# EAGLE board BlackIce (EAGLE 6.6.0), part 1 of 2
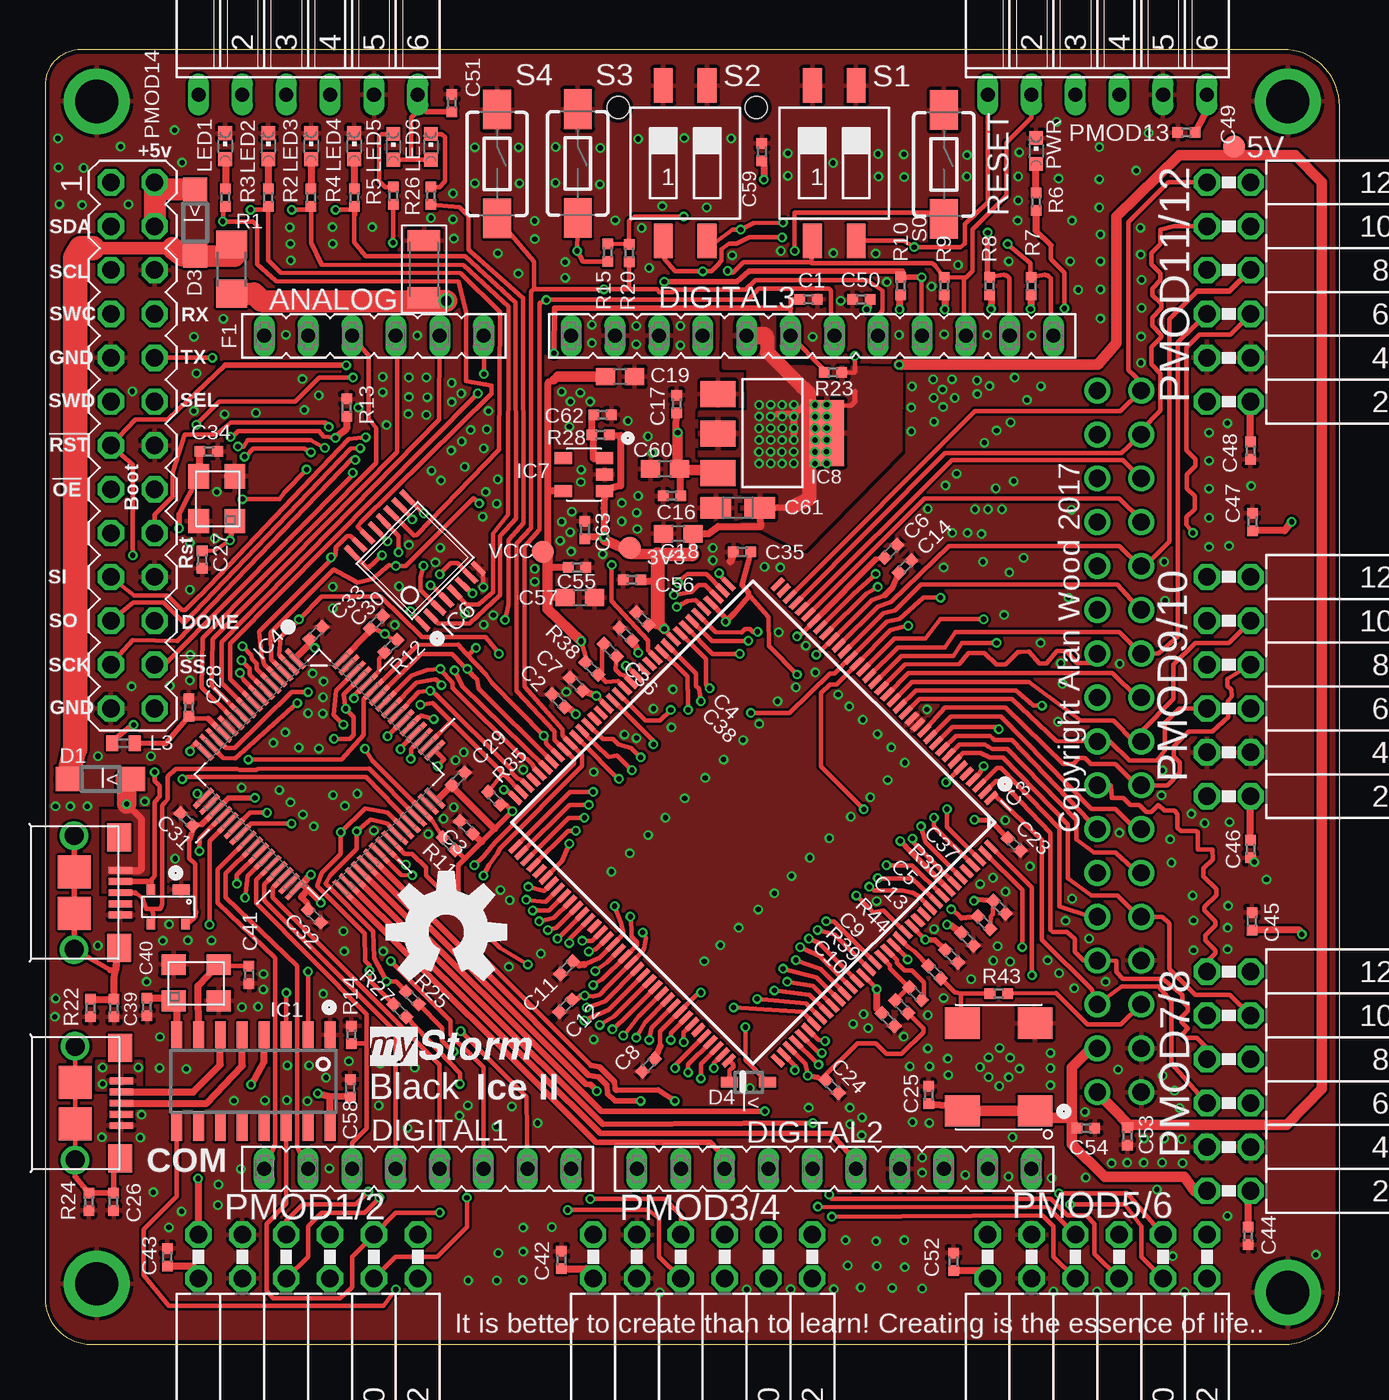
[diagram p2: board, top side]
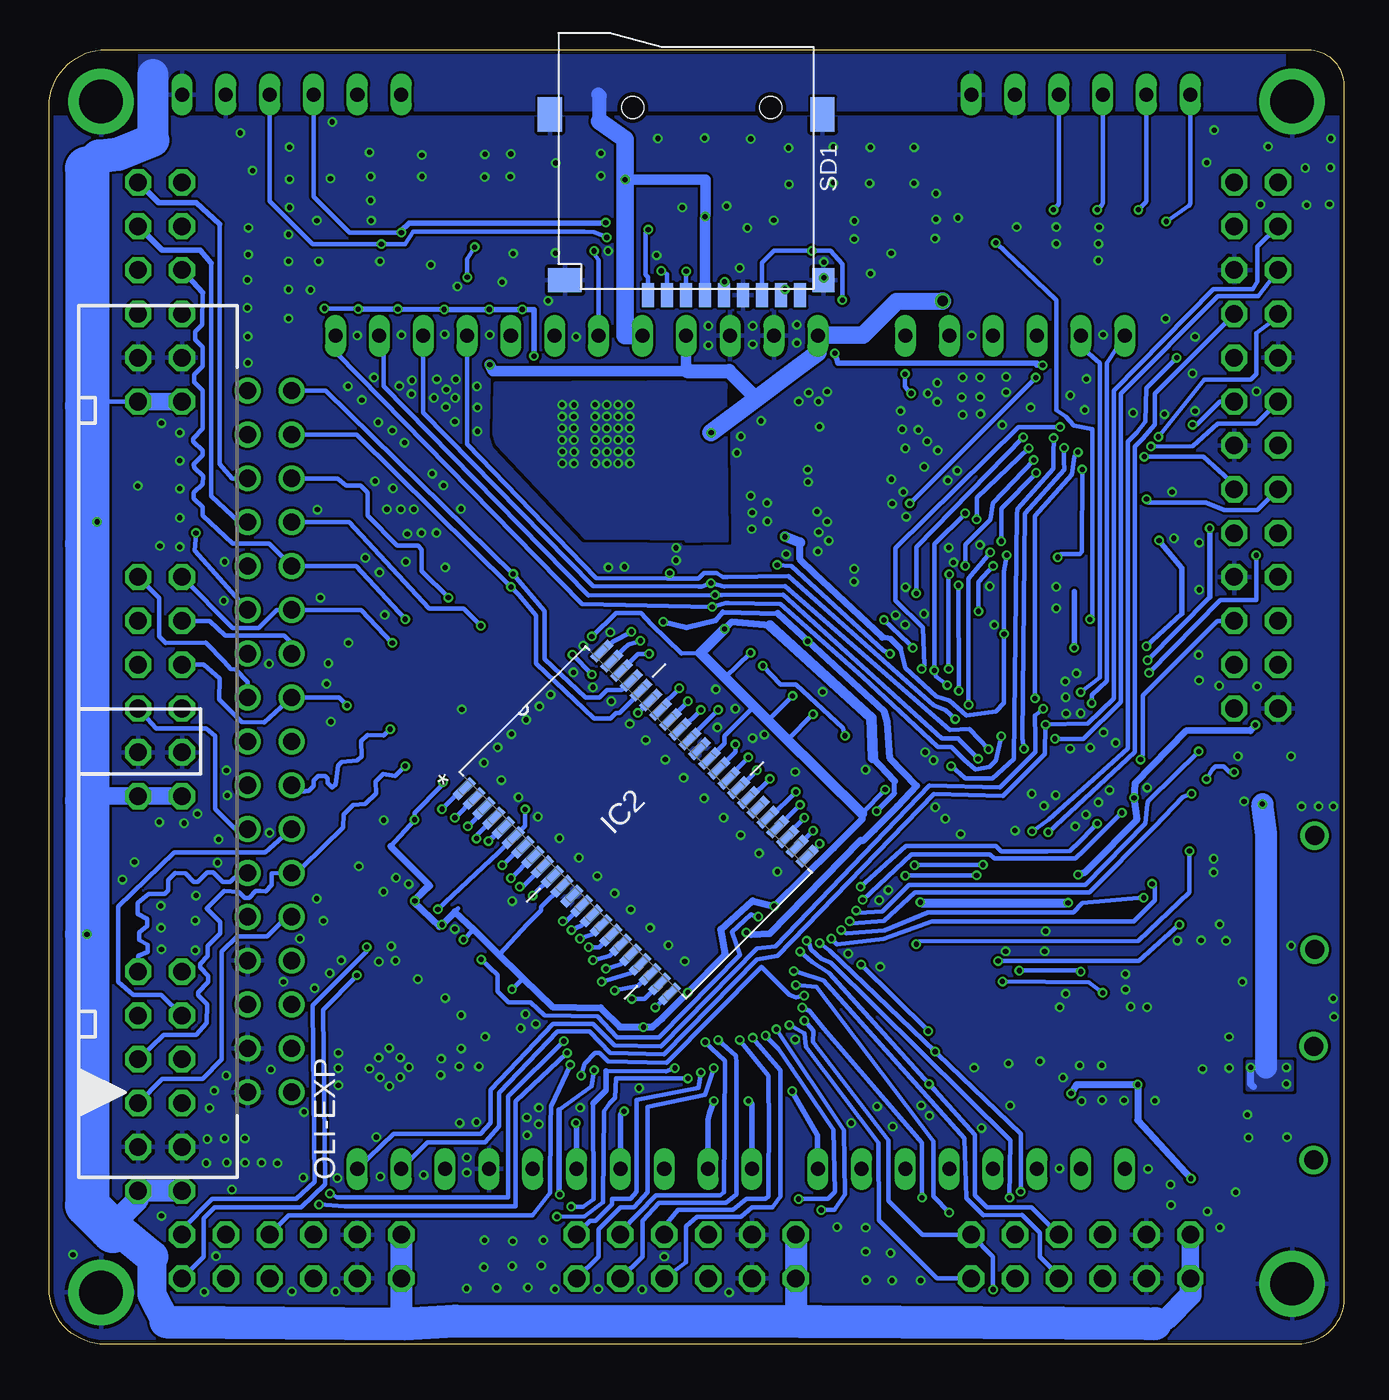
[diagram p3: board, bottom side, seen from below]

Size 75 x 75 mm. Coordinates in mm from the lower left corner, seen from the top.
Outline: 71.73,75 2.09,75 arc90 0,72.91 0,2.67 arc90 2.67,0 71.78,0 arc90 75,3.22 75,71.73 arc90 71.73,75
Copper layers (1*16): Top 0.018mm / dielectric 1.55mm / Bottom 0.018mm
Design rules "eC_2Layer_PClass6_BaseCopperO18_eCDefault *": minimum track width 0.15mm, minimum drill 0.3mm, track to track 0.15mm, track to pad 0.15mm, pad to pad 0.15mm, via to via 0.15mm, smd to smd 0mil, copper to edge 0.25mm, drill to drill 0.35mm, minimum pad ring 0.175mm, minimum via ring 0.125mm, stop-mask expansion 0mil, vias tented up to drill 0.45mm, thermal gap 0.2mm
Net classes: 2 thin_power: width 0.254 mm

## Footprints (pad centres in the part's own frame; a part is rotated, then mirrored left to right if it is on the bottom)
B1,27 = smd 1.27 x 1.27: TP 0,0
FE06 = drill 0.813 long: 1 -6.35,0; 2 -3.81,0; 3 -1.27,0; 4 1.27,0; 5 3.81,0; 6 6.35,0
C0402 = smd 0.61 x 0.61: 1 -0.508,0; 2 0.508,0
C0603 = smd 1.1 x 1: 1 -0.85,0; 2 0.85,0
1206 = smd 1.219 x 1.88: 1 -1.651,0; 2 1.651,0
R/2012-12W = smd 1.75 x 1.26: + 1.275,0; - -1.275,0
MICROUSB-B-PEG = smd 0.4 x 1.35: P$1 -1.3,2.675; P$2 -0.65,2.675; P$3 0,2.675; P$4 0.65,2.675; P$5 1.3,2.675 | drill 1.1: SH5 -3.3,0; SH6 3.3,0 | smd 1.6 x 1.4: SH@1 -3.2,2.6; SH@4 3.2,2.6 | smd 1.9 x 1.9: SH@2 -1.2,0; SH@3 1.2,0
MA13-2 = drill 1.016 octagon: 1 -15.24,-1.27; 2 -15.24,1.27; 3 -12.7,-1.27; 4 -12.7,1.27; 5 -10.16,-1.27; 6 -10.16,1.27; 7 -7.62,-1.27; 8 -7.62,1.27; 9 -5.08,-1.27; 10 -5.08,1.27; 11 -2.54,-1.27; 12 -2.54,1.27; 13 0,-1.27; 14 0,1.27; 15 2.54,-1.27; 16 2.54,1.27; 17 5.08,-1.27; 18 5.08,1.27; 19 7.62,-1.27; 20 7.62,1.27; 21 10.16,-1.27; 22 10.16,1.27; 23 12.7,-1.27; 24 12.7,1.27; 25 15.24,-1.27; 26 15.24,1.27
SOD123 = smd 1.4 x 1.4: A 1.9,0; C -1.9,0
SOD-323 = smd 1 x 0.6: A 1.1,0; C -1.1,0
FE08 = drill 0.813 long: 1 -8.89,0; 2 -6.35,0; 3 -3.81,0; 4 -1.27,0; 5 1.27,0; 6 3.81,0; 7 6.35,0; 8 8.89,0
FE10 = drill 0.813 long: 1 -11.43,0; 2 -8.89,0; 3 -6.35,0; 4 -3.81,0; 5 -1.27,0; 6 1.27,0; 7 3.81,0; 8 6.35,0; 9 8.89,0; 10 11.43,0
FE12 = drill 0.813 long: 1 -13.97,0; 2 -11.43,0; 3 -8.89,0; 4 -6.35,0; 5 -3.81,0; 6 -1.27,0; 7 1.27,0; 8 3.81,0; 9 6.35,0; 10 8.89,0; 11 11.43,0; 12 13.97,0
SOT143B = smd 1 x 0.6: 1 -0.75,-1 | smd 0.5 x 0.6: 2 1,-1; 3 1,1; 4 -1,1
R1206 = smd 1.6 x 1.803: 1 -1.422,0; 2 1.422,0
SOIC16 = smd 0.635 x 1.524: 1 -4.445,-2.695; 2 -3.175,-2.695; 3 -1.905,-2.695; 4 -0.635,-2.695; 5 0.635,-2.695; 6 1.905,-2.695; 7 3.175,-2.695; 8 4.445,-2.695; 9 4.445,2.695; 10 3.175,2.695; 11 1.905,2.695; 12 0.635,2.695; 13 -0.635,2.695; 14 -1.905,2.695; 15 -3.175,2.695; 16 -4.445,2.695
SOP80P1176X120-44N = smd 1.397 x 0.508: 1 -5.639,8.407; 2 -5.639,7.595; 3 -5.639,6.807; 4 -5.639,5.994; 5 -5.639,5.207; 6 -5.639,4.394; 7 -5.639,3.607; 8 -5.639,2.794; 9 -5.639,2.007; 10 -5.639,1.194; 11 -5.639,0.406; 12 -5.639,-0.406; 13 -5.639,-1.194; 14 -5.639,-2.007; 15 -5.639,-2.794; 16 -5.639,-3.607; 17 -5.639,-4.394; 18 -5.639,-5.207; 19 -5.639,-5.994; 20 -5.639,-6.807; 21 -5.639,-7.595; 22 -5.639,-8.407; 23 5.639,-8.407; 24 5.639,-7.595; 25 5.639,-6.807; 26 5.639,-5.994; 27 5.639,-5.207; 28 5.639,-4.394; 29 5.639,-3.607; 30 5.639,-2.794; 31 5.639,-2.007; 32 5.639,-1.194; 33 5.639,-0.406; 34 5.639,0.406; 35 5.639,1.194; 36 5.639,2.007; 37 5.639,2.794; 38 5.639,3.607; 39 5.639,4.394; 40 5.639,5.207; 41 5.639,5.994; 42 5.639,6.807; 43 5.639,7.595; 44 5.639,8.407
TQFP144 = smd 0.9 x 0.3: 1 -10.75,8.75; 2 -10.75,8.25; 3 -10.75,7.75; 4 -10.75,7.25; 5 -10.75,6.75; 6 -10.75,6.25; 7 -10.75,5.75; 8 -10.75,5.25; 9 -10.75,4.75; 10 -10.75,4.25; 11 -10.75,3.75; 12 -10.75,3.25; 13 -10.75,2.75; 14 -10.75,2.25; 15 -10.75,1.75; 16 -10.75,1.25; 17 -10.75,0.75; 18 -10.75,0.25; 19 -10.75,-0.25; 20 -10.75,-0.75; 21 -10.75,-1.25; 22 -10.75,-1.75; 23 -10.75,-2.25; 24 -10.75,-2.75; 25 -10.75,-3.25; 26 -10.75,-3.75; 27 -10.75,-4.25; 28 -10.75,-4.75; 29 -10.75,-5.25; 30 -10.75,-5.75; 31 -10.75,-6.25; 32 -10.75,-6.75; 33 -10.75,-7.25; 34 -10.75,-7.75; 35 -10.75,-8.25; 36 -10.75,-8.75; 73 10.75,-8.75; 74 10.75,-8.25; 75 10.75,-7.75; 76 10.75,-7.25; 77 10.75,-6.75; 78 10.75,-6.25; 79 10.75,-5.75; 80 10.75,-5.25; 81 10.75,-4.75; 82 10.75,-4.25; 83 10.75,-3.75; 84 10.75,-3.25; 85 10.75,-2.75; 86 10.75,-2.25; 87 10.75,-1.75; 88 10.75,-1.25; 89 10.75,-0.75; 90 10.75,-0.25; 91 10.75,0.25; 92 10.75,0.75; 93 10.75,1.25; 94 10.75,1.75; 95 10.75,2.25; 96 10.75,2.75; 97 10.75,3.25; 98 10.75,3.75; 99 10.75,4.25; 100 10.75,4.75; 101 10.75,5.25; 102 10.75,5.75; 103 10.75,6.25; 104 10.75,6.75; 105 10.75,7.25; 106 10.75,7.75; 107 10.75,8.25; 108 10.75,8.75 | smd 0.3 x 0.9: 37 -8.75,-10.75; 38 -8.25,-10.75; 39 -7.75,-10.75; 40 -7.25,-10.75; 41 -6.75,-10.75; 42 -6.25,-10.75; 43 -5.75,-10.75; 44 -5.25,-10.75; 45 -4.75,-10.75; 46 -4.25,-10.75; 47 -3.75,-10.75; 48 -3.25,-10.75; 49 -2.75,-10.75; 50 -2.25,-10.75; 51 -1.75,-10.75; 52 -1.25,-10.75; 53 -0.75,-10.75; 54 -0.25,-10.75; 55 0.25,-10.75; 56 0.75,-10.75; 57 1.25,-10.75; 58 1.75,-10.75; 59 2.25,-10.75; 60 2.75,-10.75; 61 3.25,-10.75; 62 3.75,-10.75; 63 4.25,-10.75; 64 4.75,-10.75; 65 5.25,-10.75; 66 5.75,-10.75; 67 6.25,-10.75; 68 6.75,-10.75; 69 7.25,-10.75; 70 7.75,-10.75; 71 8.25,-10.75; 72 8.75,-10.75; 109 8.75,10.75; 110 8.25,10.75; 111 7.75,10.75; 112 7.25,10.75; 113 6.75,10.75; 114 6.25,10.75; 115 5.75,10.75; 116 5.25,10.75; 117 4.75,10.75; 118 4.25,10.75; 119 3.75,10.75; 120 3.25,10.75; 121 2.75,10.75; 122 2.25,10.75; 123 1.75,10.75; 124 1.25,10.75; 125 0.75,10.75; 126 0.25,10.75; 127 -0.25,10.75; 128 -0.75,10.75; 129 -1.25,10.75; 130 -1.75,10.75; 131 -2.25,10.75; 132 -2.75,10.75; 133 -3.25,10.75; 134 -3.75,10.75; 135 -4.25,10.75; 136 -4.75,10.75; 137 -5.25,10.75; 138 -5.75,10.75; 139 -6.25,10.75; 140 -6.75,10.75; 141 -7.25,10.75; 142 -7.75,10.75; 143 -8.25,10.75; 144 -8.75,10.75
QFP50P1200X1200X160-64N = smd 1.473 x 0.279: 1 -5.715,3.759; 2 -5.715,3.251; 3 -5.715,2.743; 4 -5.715,2.261; 5 -5.715,1.753; 6 -5.715,1.245; 7 -5.715,0.762; 8 -5.715,0.254; 9 -5.715,-0.254; 10 -5.715,-0.762; 11 -5.715,-1.245; 12 -5.715,-1.753; 13 -5.715,-2.261; 14 -5.715,-2.743; 15 -5.715,-3.251; 16 -5.715,-3.759; 33 5.715,-3.759; 34 5.715,-3.251; 35 5.715,-2.743; 36 5.715,-2.261; 37 5.715,-1.753; 38 5.715,-1.245; 39 5.715,-0.762; 40 5.715,-0.254; 41 5.715,0.254; 42 5.715,0.762; 43 5.715,1.245; 44 5.715,1.753; 45 5.715,2.261; 46 5.715,2.743; 47 5.715,3.251; 48 5.715,3.759 | smd 0.279 x 1.473: 17 -3.759,-5.715; 18 -3.251,-5.715; 19 -2.743,-5.715; 20 -2.261,-5.715; 21 -1.753,-5.715; 22 -1.245,-5.715; 23 -0.762,-5.715; 24 -0.254,-5.715; 25 0.254,-5.715; 26 0.762,-5.715; 27 1.245,-5.715; 28 1.753,-5.715; 29 2.261,-5.715; 30 2.743,-5.715; 31 3.251,-5.715; 32 3.759,-5.715; 49 3.759,5.715; 50 3.251,5.715; 51 2.743,5.715; 52 2.261,5.715; 53 1.753,5.715; 54 1.245,5.715; 55 0.762,5.715; 56 0.254,5.715; 57 -0.254,5.715; 58 -0.762,5.715; 59 -1.245,5.715; 60 -1.753,5.715; 61 -2.261,5.715; 62 -2.743,5.715; 63 -3.251,5.715; 64 -3.759,5.715
TSSOP-16 = smd 0.305 x 0.991: 1 -2.275,-2.918; 2 -1.625,-2.918; 3 -0.975,-2.918; 4 -0.325,-2.918; 5 0.325,-2.918; 6 0.975,-2.918; 7 1.625,-2.918; 8 2.275,-2.918; 9 2.275,2.918; 10 1.625,2.918; 11 0.975,2.918; 12 0.325,2.918; 13 -0.325,2.918; 14 -0.975,2.918; 15 -1.625,2.918; 16 -2.275,2.918
TSOP-5/SOT23-5 = smd 0.7 x 1: 1 0.95,1.2; 2 0,1.2; 3 -0.95,1.2; 4 -0.95,-1.2; 5 0.95,-1.2
SOT223 = smd 1.499 x 2.007: 1 -2.261,-3.15; 2 0.025,-3.15; 3 2.311,-3.15 | smd 3.81 x 2.007: 4 0,3.15
C0402' = smd 0.7 x 0.9: 1 -0.65,0; 2 0.65,0
CHIPLED_0603 = smd 0.8 x 0.8: A 0,-0.75; C 0,0.75
PAK100/2500-5-34 = drill 1 pad 1.422: 1 -20.32,-1.27; 2 -20.32,1.27; 3 -17.78,-1.27; 4 -17.78,1.27; 5 -15.24,-1.27; 6 -15.24,1.27; 7 -12.7,-1.27; 8 -12.7,1.27; 9 -10.16,-1.27; 10 -10.16,1.27; 11 -7.62,-1.27; 12 -7.62,1.27; 13 -5.08,-1.27; 14 -5.08,1.27; 15 -2.54,-1.27; 16 -2.54,1.27; 17 0,-1.27; 18 0,1.27; 19 2.54,-1.27; 20 2.54,1.27; 21 5.08,-1.27; 22 5.08,1.27; 23 7.62,-1.27; 24 7.62,1.27; 25 10.16,-1.27; 26 10.16,1.27; 27 12.7,-1.27; 28 12.7,1.27; 29 15.24,-1.27; 30 15.24,1.27; 31 17.78,-1.27; 32 17.78,1.27; 33 20.32,-1.27; 34 20.32,1.27
FE06-2W = drill 1.016 octagon: 1 -6.35,1.27; 2 -6.35,-1.27; 3 -3.81,1.27; 4 -3.81,-1.27; 5 -1.27,1.27; 6 -1.27,-1.27; 7 1.27,1.27; 8 1.27,-1.27; 9 3.81,1.27; 10 3.81,-1.27; 11 6.35,1.27; 12 6.35,-1.27
FE06W = drill 0.813 long: 1 -6.35,0; 2 -3.81,0; 3 -1.27,0; 4 1.27,0; 5 3.81,0; 6 6.35,0
R0402 = smd 0.61 x 0.61: 1 -0.508,0; 2 0.508,0
TACTILE-SWITCH-1101NE = smd 2.3 x 1.6: 1 -3.15,0; 2 3.15,0
SMS-002 = smd 1.092 x 2.007: 1 -1.27,-4.496; 2 1.27,-4.496; 3 1.27,4.496; 4 -1.27,4.496
TF-PULL = smd 0.7 x 1.4: 1 -2.2,-7.62; 2 -1.1,-7.62; 3 0,-7.62; 4 1.1,-7.62; 5 2.2,-7.62; 6 3.3,-7.62; 7 4.4,-7.62; 8 5.5,-7.62; 9 6.6,-7.62 | smd 1.4 x 2: S1 -7.9,2.85; S2 7.9,2.85 | smd 1.28 x 1.4: S3 7.96,-6.75 | smd 1.95 x 1.4: S4 -7.025,-6.75 | hole 1.25: -3.1,3.25; 4.9,3.25
2.5MM-HOLE = drill 2.5 pad 3.81: P$1 0,0
XTAL-7X5 = smd 1.8 x 2: P1 -2.54,-2.1; P2 2.54,-2.1; P3 2.54,2.1; P4 -2.54,2.1
CRYSTAL-3.2X2.5 = smd 1.4 x 1.2: 1 -1.3,-1; 2 1.3,-1; 3 1.3,1.1; 4 -1.3,1.1

## Placement (x,y rotation side)
3V3  TPB1,27  [B1,27]  33.87,46.15 0 top
5V  TPB1,27  [B1,27]  68.88,69.4 0 top
ANALOG  [FE06]  19.05,58.42 180 top
C1  100nf  [C0402]  44.23,60.53 0 top
C2  100nf  [C0402]  29.73,37.28 135 top
C3  100nf  [C0402]  24.41,29.94 135 top
C4  100nf  [C0402]  34.61,42.03 135 top
C5  100nf  [C0402]  53.44,23.47 315 top
C6  100nf  [C0402]  49,45.94 225 top
C7  100nf  [C0402]  30.77,38.23 135 top
C8  100nf  [C0402]  34.96,16.17 225 top
C9  4u7  [C0402]  50.42,20.32 135 top
C10  100nf  [C0402]  48.84,18.8 135 top
C11  100nf  [C0402]  30.21,21.82 225 top
C12  100nf  [C0402]  30.17,19.61 225 top
C13  100nf  [C0402]  52.52,22.48 315 top
C14  100nf  [C0402]  49.82,45.06 45 top
C16  4.7uf  [C0402]  36.31,49.14 180 top
C17  4.7uf  [C0402]  36.59,54.47 90 top
C18  10uF  [C0603]  36.68,46.96 180 top
C19  10uF  [C0603]  33.31,56.06 0 top
C20  47uF  [1206]  21.95,62.28 90 top
C23  100nf  [C0402]  56.14,28.96 315 top
C24  100nf  [C0402]  45.59,14.93 135 top
C25  100nf  [C0402]  51.19,14.44 270 top
C26  4n7  [C0402]  3.97,8.26 90 top
C27  22pf  [C0402]  9.1,45.45 90 top
C28  100nf  [C0402]  8.33,36.89 270 top
C29  100nf  [C0402]  23.95,32.75 225 top
C30  100nf  [C0402]  19.19,41.84 225 top
C31  100nf  [C0402]  8.2,30.4 315 top
C32  4u7  [C0402]  15.61,24.81 135 top
C33  100nf  [C0402]  15.7,41.2 225 top
C34  22pf  [C0402]  9.49,51.72 180 top
C35  100nf  [C0402]  40.38,45.9 180 top
C36  4u7  [C0402]  32.75,40.21 135 top
C37  100nf  [C0402]  55.29,25.33 315 top
C38  100nf  [C0402]  33.65,41.12 135 top
C39  4n7  [C0402]  4,19.48 90 top
C40  22pf  [C0402]  5.91,19.55 90 top
C41  22pf  [C0402]  11.82,21.41 90 top
C42  4u7  [C0402]  29.92,4.89 90 top
C43  4u7  [C0402]  7.08,5.04 90 top
C44  4u7  [C0402]  69.7,6.28 270 top
C45  4u7  [C0402]  69.91,24.51 90 top
C46  100nf  [C0402]  69.83,28.68 270 top
C47  4u7  [C0402]  69.94,47.63 90 top
C48  4u7  [C0402]  69.84,51.76 270 top
C49  4u7  [C0402]  66.12,70.2 180 top
C50  4u7  [C0402]  47.29,60.52 180 top
C51  4u7  [C0402]  23.57,71.91 90 top
C52  4u7  [C0402]  52.63,4.79 90 top
C53  100nf  [C0402]  62.7,12.05 270 top
C54  100nf  [C0402]  60.3,12.53 0 top
C55  4u7  [C0402]  30.83,45 0 top
C56  100nf  [C0402]  34,44.29 180 top
C57  22uf  [C0603]  30.99,43.26 0 top
C58  100nf  [C0402]  17.68,14.83 270 top
C59  100nf  [C0402]  41.53,69.06 90 top
C60  22uf  [C0603]  35.92,50.71 180 top
C61  47uf  [R/2012-12W]  40.13,48.45 0 top
C62  100nf  [C0402]  32.3,53.85 180 top
C63  100nf  [C0402]  31.28,47.18 270 top
COM  FCI-MICROUSB-B-PEG  [MICROUSB-B-PEG]  1.75,13.97 270 top
COMS  [MA13-2]  5.08,52.07 270 top
D1  [SOD123]  3.21,32.75 0 top
D3  [SOD123]  8.69,64.97 90 top
D4  BAS70J  [SOD-323]  40.76,15.18 0 top
DIGITAL1  [FE08]  21.59,10.16 0 top
DIGITAL2  [FE10]  45.72,10.16 0 top
DIGITAL3  [FE12]  44.45,58.42 180 top
ESD1  PRTR5V0U2X  [SOT143B]  7.14,25.34 180 top
F1  [R1206]  10.8,62.29 270 top
IC1  CH340G  [SOIC16]  12.06,15.24 180 top
IC2  IS62WV25616DBLL-10TLI  [SOP80P1176X120-44N]  41.02,30.23 45 bottom
IC3  ICE40HX4K_TQFP144  [TQFP144]  41.02,30.23 225 top
IC4  STM32F103RET6  [QFP50P1200X1200X160-64N]  15.88,33.02 315 top
IC6  74CBTLV3257  [TSSOP-16]  21.43,45.4 45 top
IC7  NCP114  [TSOP-5/SOT23-5]  31.22,50.38 270 top
IC8  REG1117-5  [SOT223]  42.14,52.78 270 top
L3  1000R  [C0402']  4.55,34.82 0 top
LED1  [CHIPLED_0603]  10.44,69.41 0 top
LED2  [CHIPLED_0603]  12.94,69.41 0 top
LED3  [CHIPLED_0603]  15.41,69.41 0 top
LED4  [CHIPLED_0603]  17.91,69.41 0 top
LED5  [CHIPLED_0603]  20.18,69.37 0 top
LED6  [CHIPLED_0603]  22.35,69.37 0 top
OLI-EXP  2534-5  [PAK100/2500-5-34]  62.23,34.92 90 bottom
OSHW  OSHW-LOGOL  [OSHW-LOGO-L]  23.25,23.88 0 top
PMOD1/2  [FE06-2W]  15.24,5.08 0 top
PMOD3/4  [FE06-2W]  38.1,5.08 0 top
PMOD5/6  [FE06-2W]  60.96,5.08 0 top
PMOD7/8  [FE06-2W]  68.58,15.24 90 top
PMOD9/10  [FE06-2W]  68.58,38.1 90 top
PMOD11/12  [FE06-2W]  68.58,60.96 90 top
PMOD13  [FE06W]  60.96,72.39 0 top
PMOD14  [FE06W]  15.24,72.39 0 top
PWR  [CHIPLED_0603]  57.41,69.13 0 top
R1  470R  [R0402]  10.45,66.43 270 top
R2  1K  [R0402]  15.41,66.43 270 top
R3  470R  [R0402]  12.93,66.43 270 top
R4  1K  [R0402]  17.92,66.43 270 top
R5  470R  [R0402]  20.18,66.53 90 top
R6  1k5  [R0402]  57.41,66.19 90 top
R7  10k  [R0402]  57.13,61.3 270 top
R8  10k  [R0402]  54.72,61.3 270 top
R9  10k  [R0402]  52.08,61.3 270 top
R10  10k  [R0402]  49.57,61.3 270 top
R11  100k  [R0402]  23.4,29 135 top
R12  22k  [R0402]  20.03,40.45 45 top
R13  100k  [R0402]  17.47,54.26 270 top
R14  22k  [R0402]  17.74,17.93 90 top
R15  10k  [R0402]  32.59,63.24 90 top
R20  10k  [R0402]  33.84,63.21 90 top
R22  1M  [R0402]  2.64,19.48 270 top
R23  10k  [R0402]  45.64,56.31 0 top
R24  1M  [R0402]  2.54,8.26 270 top
R25  0R  [R0402]  21.29,20.07 315 top
R26  1K  [R0402]  22.35,66.53 90 top
R27  0R  [R0402]  20.55,19.33 315 top
R28  10k  [R0402]  32.18,52.68 180 top
R30  10k  [R0402]  54.39,24.42 315 top
R35  10k  [R0402]  26.04,31.64 135 top
R38  100R  [R0402]  31.68,39.15 135 top
R39  100R  [R0402]  49.62,19.56 135 top
R43  22R  [R0402]  55.24,20.32 0 top
R44  22R  [R0402]  51.53,21.56 135 top
S0  RS SWITCH  [TACTILE-SWITCH-1101NE]  52.07,68.35 270 top
S1  SWS002  [SMS-002]  45.72,68.42 0 top
S2  SWS002  [SMS-002]  37.08,68.42 0 top
S3  [TACTILE-SWITCH-1101NE]  30.86,68.4 270 top
S4  [TACTILE-SWITCH-1101NE]  26.19,68.38 270 top
SD1  TF-HOLDER  [TF-PULL]  38.1,68.4 0 bottom
U$2  FCI-MICROUSB-B-PEG  [MICROUSB-B-PEG]  1.69,26.16 270 top
U$16  HOLE-2.5MM  [2.5MM-HOLE]  3,3.5 0 top
U$21  HOLE-2.5MM  [2.5MM-HOLE]  3,72 0 top
U$22  HOLE-2.5MM  [2.5MM-HOLE]  72,72 0 top
U$24  HOLE-2.5MM  [2.5MM-HOLE]  72,3 0 top
VCC  TPB1,27  [B1,27]  28.82,45.91 0 top
X1  TXC-7W-20.000MBB-T  [XTAL-7X5]  55.24,16.06 90 top
Y1  12MZ  [CRYSTAL-3.2X2.5]  10,48.98 90 top
Y2  12Mz  [CRYSTAL-3.2X2.5]  8.76,20.9 0 top

## Tracks (layer width: path | path; a pad name or v marks a point on that pad's centre or on a via)
2V5
  Top 0.254: IC3.108 39.88,16.18 39.88,16.07 39.66,15.86 D4.C
5V  (via drill 0.3, 0.6)
  Top 0.254: 63.7,12.72 63.65,12.68 63.5,12.68 63.45,12.72 62.79,12.72 62.73,12.72 C53.1 | 5V.TP 68.83,69.35 68.83,68.88
  Top 0.406: C16.1 36.82,50.66 C60.1 | v36.65,52.81 36.55,52.97 C17.1
  Top 0.61: OLI-EXP.1 62.79,12.72 63.7,12.72 71.95,12.72 73.97,14.8 73.97,67.33 72.42,68.88 68.83,68.88 65.7,68.88 62.08,65.33 62.08,58 61,56.74 v49.48,56.74 | 38.99,50.71 IC8.3 38.8,50.66 36.82,50.66 | v36.65,52.81 36.65,50.83 C60.1
  Top 1.016: 21.63,60.44 C20.1
  Top 1.27: 21.63,60.44 v23.25,60.44 12.54,60.44 12.11,60.87 F1.2
  Bottom 0.61: DIGITAL3.9 38.1,57.29 38.11,56.74 38.08,56.7 38.08,56.38 49.28,56.38 v49.48,56.74 | 31.88,56.38 31.79,56.47
  Bottom 0.813: 38.08,56.38 35.61,56.38 34.03,54.79
  Bottom 1.016: v23.25,60.44 25.91,60.41 27.88,58.45 30.43,58.48 DIGITAL3.12 30.48,57.46 31.79,56.47 34.03,54.79 v36.65,52.81
100MHZ
  Top 0.254: IC3.129 50,23.03 50.09,22.97 50.38,22.75 R44.2
!ESS  (via drill 0.3)
  Top 0.254: COMS.24 6.92,39.37 17.83,50.34 v17.82,50.48 | v19.84,46.51 19.14,47.22 IC6.13
  Bottom 0.254: v17.82,50.48 19.84,48.42 v19.84,46.51
!QCS  (via drill 0.3)
  Top 0.254: IC3.81 29.2,25.12 v28.25,25.12 | IC4.16 8.75,34.83 8.46,34.55 v8.41,34.35
  Bottom 0.254: v28.25,25.12 28.12,25 26.73,25.06 25.19,26.61 14.99,26.61 11.49,30.18 11.37,31.3 arc45 11.28,31.52 v8.41,34.35
!RESET  (via drill 0.3)
  Top 0.254: IC4.7 11.5,38.47 v11.29,38.89 | 10.43,56.72 7.1,53.57 5.23,53.57 COMS.13 5.08,50.96 v5.08,45.71 | S0.2 51.7,65.56 43.41,65.56 43.41,63.63 v43.43,63.34 | C1.1 43.18,60.53 43.19,60.04 43.18,59.22 DIGITAL3.7 45.14,56.46 R23.1
  Top 0.305: 43.19,60.04 29.51,60.04 v29.48,57.41 | 10.43,56.72 v17.45,56.72
  Bottom 0.254: v11.29,38.89 7.16,43.11 5.08,43.11 v5.08,45.71 | v43.43,63.34 43.43,63.18 43.18,62.8 DIGITAL3.7
  Bottom 0.305: v29.48,57.41 29.3,56.84 29.27,56.83 17.78,56.83 17.78,56.72 v17.45,56.72
!SS  (via drill 0.3)
  Top 0.254: IC3.71 26.62,32.97 | 26.62,32.97 23.6,35.98 | 23.6,35.98 22.44,37.15 v21.74,37.05 | R35.2 26.45,32.97 26.62,32.97 | IC6.12 20.48,46.81 v20.48,45.88 | IC4.50 23.44,35.98 23.6,35.98
  Bottom 0.254: v20.48,45.88 21.74,44.36 v21.74,37.05
+3V3  (via drill 0.3)
  Top 0.254: 48.14,45.48 C6.2 | C4.1 35.26,41.7 35.74,41.69 v35.88,41.44 35.88,41.39 IC3.46 | 35.64,17.26 35.62,17.25 35.62,18.11 IC3.100 37.83,20.31 v38,20.38 | C10.2 48.19,19.45 | IC3.123 48.19,20.59 v48.19,20.56 | IC3.131 v51,23.44 | IC3.6 v52.19,32.56 | IC3.30 43.67,41 v43.57,41 | 31.91,37.56 v31.94,37.56 v31.94,37.55 IC3.57 | 52.4,24.31 v52.25,24.31 | 53.75,25.81 v53.82,25.69 | C38.1 34.17,40.51 | C18.1 37.5,46.5 | 41.64,58.42 41.81,58.42 | C2.1 30.43,36.8 | D4.A 40.58,16.46 v40.58,18.38 | 52.88,13.79 X1.P4 | C54.1 59.65,12.97 59.5,13.12 | C37.1 54.91,24.96 54.91,24.91 54.88,24.91 54.86,24.89 54.79,24.78 R30.2 | 3V3.TP 33.86,45.84 | 33.86,45.84 33.66,45.84 | 33.86,45.84 34.1,45.84 | 18.76,41.22 C30.2 18.94,41.32 19.1,41.48 v19.68,41.15 20.32,40.74 R12.2 | IC6.16 18.69,44.93 v19.53,45.72 | ESD1.4 8.19,24.4 arc45 8.74,24.81 8.76,25.08 8.7,25.15 8.7,27.81 8.36,28.16 8.36,29.21 | 8.49,29.61 arc45 8.59,29.83 C31.2 | 67.25,71.34 67.37,71.82 PMOD13.6 | 58.26,63.66 58.26,62.87 59.05,62.07 v59.05,60.01 | IC4.32 14.53,26.32 15.06,26.85 | R15.2 R20.2 33.85,65.09 34.15,65.33 v37.01,65.33 | R11.1 24.32,28.13 24.53,28.34 | 25.29,29.11 25.3,29.11 | R35.1 26.72,31.27 v27.07,30.88 | v26.57,32.14 26.71,32.17 IC3.72 | 25.16,29.05 25.24,29.05 | 22.83,31.64 IC4.48 | 31.25,22 32.11,22.38 IC3.89 33.25,23.51 33.52,23.81 33.38,24.4 v33,25.38 | 30.95,21.95 C11.1 | v46.92,57.25 46.91,56.33 46.89,56.3 46.16,56.3 R23.2 | LED5.A 21.14,68.62 | 21.14,68.62 LED6.A | 21.14,68.62 21.21,68.68 21.21,71.05 21.6,71.44 | v47.59,59.95 47.78,60.06 C50.1
  Top 0.3: 45.83,54.39 46.72,54.4
  Top 0.302: v24.53,25.62 23.97,26.12 23.97,27.78 24.53,28.34 25.24,29.05 25.3,29.11 26.05,29.86 v27.07,30.88 | 46.72,54.4 46.93,54.61 46.93,55.2
  Top 0.305: IC3.30 48.14,45.48 | C13.1 51.55,23.44 v51,23.44 | C23.1 54.76,30.34 v53.84,30.39 | C37.1 53.75,25.81 | C31.2 9.08,30.11 IC4.19 10.63,31.65 v12.15,31.65 | R7.2 57.12,60.64 | R8.2 54.83,60.54 | R9.2 52.12,60.61 | R10.2 49.5,60.58 | C56.1 34.55,44.23 | 14.85,25.91 15.23,25.54 C32.2 | v5.13,35.88 4.97,35.81 4.1,35.1 L3.1 | 45.83,54.39 45.38,53.92 44.33,53.92 44.25,53.85 | IC4.64 18.76,41.22 | 21.6,71.41 21.6,71.44 21.6,71.88 | 21.6,71.88 PMOD14.6 | 8.36,29.21 8.49,29.61 | 57.41,64.51 58.26,63.66 | 43.92,54.39 43.47,53.92 42.42,53.92 42.34,53.85 | C51.1 22.08,71.4 21.6,71.88
  Top 0.406: 35.64,17.26 C8.1 | 48.19,19.45 v48.19,20.56 | C7.1 31.91,37.56 | C5.1 52.4,24.31 | 34.17,40.51 v34.37,40.06 | 30.43,36.8 v30.75,36.5 | PMOD7/8.2 69.7,8.74 C44.1 | v72.81,23.75 72.69,24 C45.1 | PMOD9/10.2 69.83,31.5 C46.1 | v72.22,47.65 71.82,47.13 C47.1 | PMOD11/12.2 69.83,54.59 C48.1 | 57.12,60.64 v57.1,59.98 | 54.83,60.54 v54.8,59.98 | 52.12,60.61 v52.12,59.95 | 49.5,60.58 v49.5,59.95 | C25.2 52.88,13.79 | 34.55,44.23 35.48,44.23 | C49.1 67.25,71.34 | R6.1 57.41,64.51 | C42.1 31.32,4.38 PMOD3/4.2 | C43.1 8.58,4.53 PMOD1/2.2 | C52.1 54.28,4.28 PMOD5/6.2 | v15.4,27.2 15.06,26.85 14.92,26.67 15.24,26.35 | 15.24,26.35 14.85,25.91 | v15.97,25.57 16.02,25.57 15.24,26.35 | C3.1 25.29,29.11 | 22.83,31.64 C29.2 23.59,32.32 26.05,29.86 | 31.25,22 30.95,21.95 | C59.1 41.64,68.3 v41.64,67.47 | IC1.4 12.68,16.36 v11.94,15.04 | v15.8,14.53 16.48,14.35 | 16.48,14.35 16.48,13.31 IC1.16 | C58.2 16.5,14.36 16.48,14.35 | v8.87,9.6 8.87,6.38 PMOD1/2.1 | 45.38,53.92 45.26,53.92 IC8.4 45.29,52.76 | R28.1 33.35,52.65 33.35,49.73 32.42,49.48 IC7.1 32.38,48.41 v32.38,46.78 31.39,46.78 C63.2 | 43.2,48.49 C61.+ 41.47,47.37 38.99,47.37 38.45,46.96 C18.1 | 37.5,46.5 37.49,46.5 37.49,45.76 | 43.47,53.92 43.36,53.92 43.38,52.78 43.38,52.76 | 33.98,45.77 33.66,45.78 33.66,45.84
  Top 0.61: 34.1,45.84 32.45,46.6 v32.38,46.78 | 33.98,45.77 35.48,45.77 | 35.48,41.84 v35.88,41.44 | PMOD7/8.1 66.58,8.89 66,9.7 61.39,9.7 59.5,11.59 59.5,13.12 | X1.P4 X1.P1 57.74,13.12 59.5,13.12 | 59.5,13.12 59.5,16.05 60.59,17.14 OLI-EXP.3
  Top 0.813: 41.81,58.42 41.81,57.5 43.78,55.54 44.25,55.12 44.25,53.85 44.25,48.96 43.31,48.51 | 35.48,41.84 35.48,44.23 35.48,45.77 37.49,45.76
  Top 1.016: DIGITAL3.8 41.64,58.42
  Bottom 0.254: PMOD11/12.2 72.58,54.61 | PMOD9/10.1 PMOD9/10.2 | 37.28,40.04 38.37,40.02 40.1,41.7 40.73,42.35 42.16,42.38 v43.57,41 | v43.57,41 43.66,40.91 v43.57,41 | v53.84,30.39 53.84,30.78 52.26,32.38 52.16,32.51 v52.19,32.56 | v53.84,30.39 55.22,28.84 v53.84,30.39 | 48.91,22.54 48.94,22.56 47.28,24.34 46.5,25.12 46.5,25.33 IC2.11 | v48.19,20.56 47.55,21.2 47.81,21.45 | v51,23.44 50.41,24.03 50.42,24.03 | v31.94,37.56 33.29,36.21 33.29,36.08 | IC2.33 35.88,34.8 35.88,35.25 34.2,36.92 34.2,36.98 | v52.25,24.31 51.31,25.25 51.51,25.05 | v30.75,36.5 32.23,35.02 | v53.82,25.69 52.88,26.56 53.01,26.62 | v34.37,40.06 35.86,38.63 36.24,39.01 | 25.7,40.3 25.39,39.19 23.59,37.52 22.86,37.31 21.86,36.42 20.16,36.67 19.68,37.15 v19.68,41.15 19.68,44.77 v19.53,45.72 | v26.57,32.14 27.93,30.75 | v59.05,60.01 57.13,60.01 v57.1,59.98 | v37.01,65.33 36.99,67.47 | v33,25.38 32.93,25.44 | v41.64,67.47 41.53,67.58
  Bottom 0.302: v27.07,30.88 26.04,31.91 26.04,32.62
  Bottom 0.305: 25.7,40.3 26.27,40.87 26.73,40.96 | v46.92,57.25 46.92,59.95 47.18,59.95 v47.59,59.95 47.62,59.95 v49.5,59.95 v52.12,59.95 v54.8,59.98 v57.1,59.98
  Bottom 0.406: 55.22,28.84 53.01,26.62 53.91,25.65 52.39,24.19 52.26,24.26 51.51,25.01 51.51,25.05 50.42,24.03 48.94,22.56 | 48.91,22.54 47.81,21.45 47.56,21.21 45.85,19.56 43.05,19.49 41.93,18.38 v40.58,18.38 40.06,18.38 39.5,18.88 v38,20.38 35.83,22.59 36.09,24.04 34.26,25.69 v33,25.38 32.93,25.44 29.56,28.75 29.02,29.3 27.9,30.43 27.93,30.75 | v5.13,35.88 5.42,35.55 9.16,35.52 12.1,32.5 v12.15,31.65 11.99,30.37 14.71,27.64 15.04,27.3 v15.4,27.2 | 26.73,40.96 30.64,44.61 31.5,45.47 31.5,46.43 | 52.05,1.72 51.48,1.35 | v72.22,47.65 72.22,46.96 72.81,46.38 | 26.04,32.62 27.27,33.96 | 33.26,41.62 35.48,41.83 v35.88,41.44 | v8.87,9.6 11.94,12.98 v11.94,15.04 15.49,15.04 v15.8,14.53
  Bottom 0.508: v15.97,25.57 24.47,25.57 v24.53,25.62
  Bottom 0.61: 27.93,30.75 32.54,35.33 | 32.54,35.33 33.29,36.08 34.2,36.98 36.24,39.01 37.28,40.04 37.05,40.26 v35.88,41.44 | 32.23,35.02 32.54,35.33 | 31.5,46.43 v32.38,46.78 | SD1.4 37,63.19 36.99,67.47 v41.64,67.47 | 27.27,33.96 27.36,36.28 33.26,41.62
  Bottom 0.813: 43.11,70.87 43.11,72.32 43.18,72.39
  Bottom 1.016: PMOD11/12.1 PMOD11/12.2 | PMOD9/10.1 72.56,31.75 | PMOD1/2.1 PMOD1/2.2 | 43.11,70.87 41.64,69.8 v41.64,67.47 41.64,58.42 DIGITAL3.8
  Bottom 1.27: 72.58,54.61 72.81,54.38 | 72.56,31.75 72.81,31.5 | PMOD7/8.1 PMOD7/8.2 69.85,8.4 71.5,6.75 | PMOD3/4.1 PMOD3/4.2 31.75,1.65 31.43,1.33 | 54.44,1.2 54.61,1.49 PMOD5/6.2 PMOD5/6.1 | PMOD1/2.2 8.89,2.86 10.32,1.43 11.2,1.43 11.43,1.2
  Bottom 1.676: 69.06,5.06 69.06,2.88 68.25,1.31
  Bottom 1.8: 69,73.58 69,69.75
  Bottom 1.9: 68.25,1.31 54.44,1.2 51.48,1.35 31.43,1.33 30.42,1.33 11.43,1.2 10.95,1.2
  Bottom 1.93: 69,69.75 71,68.94 72,68.81 72.12,68.81 72.81,68.12 | 71.31,6.56 70.88,6.56 69.06,5.06
  Bottom 2.54: 72.81,68.12 72.81,54.38 72.81,46.38 72.81,31.5 v72.81,23.75 72.81,8.06 71.5,6.75 71.31,6.56
  other vias: 45.28,52.39 45.28,53.07 45.28,53.75 45.27,51.71 44.6,51.02 45.28,51.03 44.6,54.42 44.61,53.74 45.28,54.43 44.59,51.7 44.6,52.38 44.61,53.06 43.38,52.39 43.38,53.07 43.38,53.75 43.37,51.71 42.69,51.02 43.37,51.03 42.7,54.42 42.7,53.74 43.38,54.43 42.69,51.7 42.7,52.38 42.7,53.06 42.05,52.39 42.05,53.07 42.05,53.75 42.03,51.71 41.36,51.02 42.04,51.03 41.36,54.42 41.37,53.74 42.05,54.43 41.36,51.7 41.37,52.38 41.37,53.06
  pour Bottom: 3.43,76.01 69.79,75.95 69.79,71.5 3.43,71.5
  pour Top: 39.4,59.49 39.37,56.62 40.78,56.62 40.81,53.98 37.97,53.95 37.97,51.51 40.44,51.54 40.44,47.33 41.43,47.33 43.9,46.08 49.53,51.79 49.56,56.49 42.19,56.62 42.19,59.49
  pour Bottom: 35.96,55.74 49.15,55.64 49.21,52.73 49.03,52.17 43.89,46.72 42.24,46.72 38.16,46.66 38.06,46.52 36.46,46.58 35.78,46.57 35.84,54.99 35.83,55.71
+5V
  Top 1.27: COMS.4 COMS.2 6.79,66.87 D3.A
A0  (via drill 0.3)
  Top 0.305: IC3.137 50.13,28.55 v49.55,29.15
  Bottom 0.305: v49.55,29.15 48.75,29.93 IC2.5
A1  (via drill 0.3)
  Top 0.254: IC3.138 50.25,29.14 v50.25,29.3
  Bottom 0.254: v50.25,29.3 50.25,29.48 IC2.4
A2  (via drill 0.3)
  Top 0.254: IC3.139 51,29.09 v50.75,30
  Bottom 0.254: v50.75,30 49.83,30.92 IC2.3
A3  (via drill 0.3)
  Top 0.254: IC3.141 51.5,30.01 v51.5,30.5
  Bottom 0.254: v51.5,30.5 IC2.2
A4  (via drill 0.3)
  Top 0.254: IC3.142 52.25,29.96 v52.25,31
  Bottom 0.254: v52.25,31 51.06,32.19 IC2.1
A5  (via drill 0.3)
  Top 0.254: IC3.42 38.84,41.25 40.35,41.23 40.55,41.42 40.85,41.42 41,41.27 v41.27,41.27
  Bottom 0.254: v41.27,41.27 42.33,40.7 42.84,40.19 42.84,40.16 IC2.44
A6  (via drill 0.3)
  Top 0.254: IC3.43 38.64,40.75 v40.75,40.75
  Bottom 0.254: v40.75,40.75 41.45,40.55 41.69,40.31 IC2.43
A7  (via drill 0.3)
  Top 0.254: IC3.44 38.68,40 v40.25,40
  Bottom 0.254: v40.25,40 40.88,40 IC2.42
A8  (via drill 0.3)
  Top 0.254: IC3.73 30.42,32 v31.75,32
  Bottom 0.254: v31.75,32 33.22,30.54 IC2.27
A9  (via drill 0.3)
  Top 0.254: IC3.74 30.38,31.25 v31.5,31.25
  Bottom 0.254: v31.5,31.25 32.77,29.98 IC2.26
A10  (via drill 0.3)
  Top 0.254: IC3.75 30.34,30.5 v31.25,30.5
  Bottom 0.254: v31.25,30.5 32.22,29.53 IC2.25
A11  (via drill 0.3)
  Top 0.254: IC3.76 30.29,29.75 v30.75,29.75
  Bottom 0.254: v30.75,29.75 31.65,28.85 IC2.24
A12  (via drill 0.3)
  Top 0.254: IC3.115 43.87,19.25 v39.89,19.51
  Bottom 0.254: v39.89,19.51 39.98,19.41 IC2.22
A13  (via drill 0.3)
  Top 0.254: IC3.116 44.08,19.75 v41.25,20
  Bottom 0.254: v41.25,20 40.52,20 IC2.21
A14  (via drill 0.3)
  Top 0.254: IC3.117 44.29,20.25 v42.25,20.5
  Bottom 0.254: v42.25,20.5 40.88,20.75 IC2.20
A15  (via drill 0.3)
  Top 0.254: IC3.118 44.49,20.75 v43,21
  Bottom 0.254: v43,21 41.28,21.5 IC2.19
A16  (via drill 0.3)
  Top 0.254: IC3.119 44.7,21.25 v42.75,21.75
  Bottom 0.254: v42.75,21.75 41.89,22 IC2.18
A17  (via drill 0.3)
  Top 0.254: IC3.78 29.96,28 v30.38,29
  Bottom 0.254: v30.38,29 30.52,28.77 IC2.23
A18
  Bottom 0.254: 33.89,31.11 IC2.28
AN0  (via drill 0.3)
  Top 0.254: ANALOG.1 v25.43,56.21 | v25.07,55.08 10.73,40.6 10.72,38.54 IC4.8
  Bottom 0.254: v25.43,56.21 25.43,55.47 v25.07,55.08
AN1
  Top 0.254: ANALOG.2 22.84,53.57 10.22,40.69 10.22,38.31 IC4.9
AN2
  Top 0.254: ANALOG.3 20.32,57.85 20.38,57.78 20.4,51.7 9.71,40.85 9.65,38.17 IC4.10
AN3
  Top 0.254: ANALOG.4 18.57,57.47 18.73,57.31 18.73,53.66 19.18,53.09 19.18,51.06 9.14,40.9 9.08,38.06 IC4.11
AN4  (via drill 0.3)
  Top 0.254: v15.24,37.78 14.29,37.78 10.99,34.56 10.46,34.56 IC4.14
  Bottom 0.254: 15.24,57.78 14.15,56.83 14.15,38.63 v15.24,37.78
  Bottom 0.305: 15.24,57.78 ANALOG.5
AN5  (via drill 0.3)
  Top 0.254: v14.61,37.15 11.01,33.95 10.32,33.97 IC4.15
  Bottom 0.254: ANALOG.6 13.74,56.83 13.74,38.42 14.61,37.62 v14.61,37.15
B1  (via drill 0.3)
  Top 0.254: IC4.39 20.64,27.18 v21.27,27.16 | v25.4,27.15 25.72,27.78 26.19,28.42 26.35,28.73 31.11,33.5 31.11,34.13 IC3.63 29.97,35.27 29.97,35.62 27.77,38.1 27.77,46.22 28.66,47.2 28.66,60.32 v29.05,60.49 29.14,60.52 40.77,60.52 41.34,61.15 45.4,61.15 45.53,61.02 45.53,59.05 45.72,58.86 DIGITAL3.6 | R15.1 31.16,62.73 v30.82,63.34 30.84,64.42 S3.2
  Bottom 0.254: v29.05,60.49 29.05,62.58 29.73,63.34 v30.82,63.34 33.02,63.34 33.7,62.66 SD1.7 | v21.27,27.16 v25.4,27.15
B2  (via drill 0.3)
  Top 0.254: IC4.40 20.6,27.94 v20.9,27.78 | v24.87,27.76 25.4,28.26 26.04,29.05 30.64,33.66 30.64,33.9 IC3.64 29.53,35.01 29.53,35.5 27.32,37.83 27.32,46.37 28.14,47.28 28.17,60.99 28.29,61.12 | 28.29,61.12 v32.38,61.12 33.84,61.12 | R20.1 33.84,61.12 | S4.2 28.32,62.71 28.32,61.15 28.29,61.12 | 33.84,61.12 35.46,61.12 35.56,60.96 36.39,60.96 36.45,61.09 40.58,61.09 41.15,61.66 47.62,61.66 48.51,61.02 48.51,59.88 48.26,59.56 DIGITAL3.5
  Bottom 0.254: v20.9,27.78 v24.87,27.76 | SD1.8 v32.38,61.12
BOOT  (via drill 0.3)
  Top 0.254: v17.9,37.42 17.96,37.65 18.36,38.04 IC4.60 19.37,38.99 19.37,39.69 19.73,40.05 R12.1 | v15.4,51.68 15.01,51.88 14.73,51.88 12.06,51.88 11.61,51.42 v11.56,51.42
  Bottom 0.254: v17.9,37.42 17.9,47.98 15.77,50.39 15.62,51.44 15.45,51.61 15.45,51.63 v15.4,51.68 | v11.56,51.42 8.15,51.44 6.35,49.8 COMS.16
C14
  Top 0.305: LED1.A 10.45,68.64
  Top 0.406: 10.45,68.64 R1.1
C15
  Top 0.305: LED2.A 12.93,68.65
  Top 0.406: 12.93,68.65 R3.1
C16
  Top 0.305: LED3.A
  Top 0.406: LED3.A R2.1
C17
  Top 0.305: LED4.A
  Top 0.406: LED4.A R4.1
D0  (via drill 0.3)
  Top 0.254: v48.75,27.75 50.22,27.75 IC3.136
  Bottom 0.254: v48.75,27.75 47.71,28.79 IC2.7
D1  (via drill 0.3)
  Top 0.254: v48.25,27 49.56,27 49.61,26.99 50.23,26.99 51.63,25.65 IC3.135
  Bottom 0.254: v48.25,27 47.03,28.22 IC2.8
D2  (via drill 0.3)
  Top 0.254: v47.75,26.5 48.01,26.29 49.66,26.3 50.16,26.17 50.22,26.16 50.61,25.97 51.28,25.3 IC3.134
  Bottom 0.254: v47.75,26.5 47.59,26.5 IC2.9
D3  (via drill 0.3)
  Top 0.254: v47,26 47.83,25.19 47.97,25.02 48.58,25.15 IC3.130
  Bottom 0.254: v47,26 45.91,27.09 IC2.10
D4  (via drill 0.3)
  Top 0.254: IC3.125 45.69,24.5 v45.25,24.5
  Bottom 0.254: v45.25,24.5 45.07,24.5 IC2.13
D5  (via drill 0.3)
  Top 0.254: IC3.124 45.74,23.75 v44.75,24
  Bottom 0.254: v44.75,24 44.17,24.25 IC2.14
D6  (via drill 0.3)
  Top 0.254: IC3.122 44.82,23.25 v44.25,23.5
  Bottom 0.254: v44.25,23.5 43.55,23.75 IC2.15
D7  (via drill 0.3)
  Top 0.254: IC3.121 44.87,22.5 v43.75,23
  Bottom 0.254: v43.75,23 43.15,23 IC2.16
D8  (via drill 0.3)
  Top 0.254: v33.25,32.75 33,32.96 32.37,33.59 31.94,34.04 30.8,35.18 IC3.62
  Bottom 0.254: v33.25,32.75 34.33,31.67 IC2.29
D9  (via drill 0.3)
  Top 0.254: 34,33.37 v34,33.25 33.15,34.1 32.64,34.04 31.2,35.41 IC3.61
  Bottom 0.254: v34,33.25 35.01,32.24 IC2.30
D10  (via drill 0.3)
  Top 0.254: v34.5,34 34.5,33.98 33.94,34.54 33.21,34.73 32.89,35.05 32.32,35.05 IC3.60
  Bottom 0.254: v34.5,34 35.45,33.05 IC2.31
D11  (via drill 0.3)
  Top 0.254: v35.25,34.75 35.31,34.89 34.73,35.46 IC3.56
  Bottom 0.254: v35.25,34.75 35.25,34.32 IC2.32
D12  (via drill 0.3)
  Top 0.254: 36.25,36.77 v36.25,36.75 35.63,36.13 34.8,36.13 33.27,37.66 IC3.55
  Bottom 0.254: v36.25,36.75 37.88,35.12 IC2.35
D13  (via drill 0.3)
  Top 0.254: v37.25,36.75 37.25,37.89 37.21,37.93 37.21,38.67 35.75,40.13 IC3.48
  Bottom 0.254: v37.25,36.75 38.36,35.64 IC2.36
D14  (via drill 0.3)
  Top 0.254: v38,37.25 37.88,37.98 37.72,38.13 37.72,38.86 36.1,40.48 IC3.47
  Bottom 0.254: v38,37.25 39.01,36.24 IC2.37
D15  (via drill 0.3)
  Top 0.254: 38.5,38.06 v38.5,38 38.29,38.21 38.29,39.69 IC3.45
  Bottom 0.254: v38.5,38 39.59,36.91 IC2.38
D+
  Top 0.254: IC4.45 18.78,33.36 12.32,33.33 12.24,33.27 11.28,33.27 11.12,33.34 7.56,33.34 7.11,32.89 7.11,31.59 6.92,31.37 arc45 6.78,31.14 6.78,25.57 arc-45 6.66,25.22 5.89,25.22 5.85,25.22 | 5.21,26.15 5.63,25.89 5.85,25.22 | ESD1.3 arc45 6.19,25.23 5.85,25.22
  Top 0.305: U$2.P$3 5.21,26.15
D-  (via drill 0.3)
  Top 0.254: IC4.44 18.59,32.86 9.05,32.86 8.25,32.86 v7.95,32.74 | ESD1.2 arc-45 6.17,26.48 6.17,26.86 5.92,26.8 6.08,26.8 6.35,27.13 6.35,31.42 6.66,31.73 6.66,32.33 6.35,32.64 v6.35,33.15
  Top 0.305: 5.92,26.8 U$2.P$2
  Bottom 0.254: v6.35,33.15 6.63,33.15 6.96,33.48 7.44,33.48 7.62,33.3 7.7,33.15 v7.95,32.74
DBG1  (via drill 0.3)
  Top 0.254: IC4.2 13.57,39.92 13.65,40.96 14.64,41.89 v14.71,41.99 16.02,43.31 19.43,43.31 21.84,40.96 25.53,40.96 v26.29,40.01 | v20.16,63.82 20.16,65.72 R5.1 | IC3.49 34.92,40.22 34.92,40.77 32.83,43.05 v32.83,45.15
  Bottom 0.254: v14.71,41.99 14.57,41.9 14.57,53.03 15.65,53.22 16.1,53.75 16.67,54.12 16.67,60.48 v20.16,63.82 | v32.83,45.15 32,45.09 26.67,40.2 v26.29,40.01
DIG0
  Top 0.254: IC4.24 10,27.5 10,25.56 13.34,22.38 13.34,11.59 DIGITAL1.1
DIG1
  Top 0.254: IC4.25 10.48,27.26 10.48,25.88 14.61,21.91 14.61,11.43 DIGITAL1.2
DIG2
  Top 0.254: DIGITAL1.3 17.78,11.66 18.64,12.52 18.64,17.44 | 18.64,17.44 18.64,19.11 12.22,25.56 12.22,26.89 IC4.28 | R14.1 17.85,17.44 18.64,17.44
DIG3
  Top 0.254: DIGITAL1.4 20.32,18.1 12.7,25.72 12.7,26.65 IC4.29
DIG4
  Top 0.254: DIGITAL1.5 22.86,16.19 13.18,25.88 13.18,26.44 IC4.30
DIG5  (via drill 0.3)
  Top 0.254: DIGITAL1.6 25.4,16.03 23.5,17.93 23.5,18.73 v20.03,22.2 | IC4.21 9.53,29.15 v9.53,24.31
  Bottom 0.254: v9.53,24.31 11.89,22.2 v20.03,22.2
DIG6  (via drill 0.3)
  Top 0.254: IC4.41 20.84,28.42 21.27,28.42 22.07,27.62 22.07,27.15 26.37,22.95 v27.96,22 | DIGITAL1.7 27.89,14.33 v24.08,18.14
  Bottom 0.254: v27.96,22 v24.08,18.14
DIG7  (via drill 0.3)
  Top 0.305: IC4.37 31.34,15.05 31.61,15.05 31.86,14.8 v31.96,14.66
  Bottom 0.305: v31.96,14.66 30.49,12.09 DIGITAL1.8
DIG8  (via drill 0.3)
  Top 0.254: DIGITAL2.1 34.14,10.16
  Top 0.305: IC4.38 31.49,15.57 32.06,15.49 32.55,15 32.6,14.49 33.03,14.1 v34.5,14.1
  Bottom 0.305: v34.5,14.1 34.29,13.89 DIGITAL2.1
DIG9  (via drill 0.3)
  Top 0.254: IC4.20 8.97,29.31 v8.94,28.57 | v24.77,23.18 24.77,23.02 31.63,16.16
  Top 0.305: 31.63,16.16 32.13,16.07 33,15.2 33.03,14.79 33.12,14.7 35.52,14.73 v36.49,14.1
  Bottom 0.254: v8.94,28.57 8.94,26.19 11.92,23.36 24.61,23.34 v24.77,23.18
  Bottom 0.305: v36.49,14.1 36.74,13.38 36.83,12.99 DIGITAL2.2
DIG10
  Top 0.305: IC4.33 31.93,11.7 38.54,11.7 39.37,10.82 DIGITAL2.3
DIG11  (via drill 0.3)
  Top 0.305: IC4.36 32.23,13.5 v41.7,13.5
  Bottom 0.305: v41.7,13.5 41.91,13.29 DIGITAL2.4
DIG12  (via drill 0.3)
  Top 0.305: IC4.35 32.33,12.75 v44.48,12.82
  Bottom 0.305: v44.48,12.82 44.45,12.64 DIGITAL2.5
DIG13
  Top 0.305: IC4.34 32.19,12.22 45.53,12.21 46.99,10.6 DIGITAL2.6
DIG16  (via drill 0.3)
  Top 0.254: v55.76,63.74 57.08,62.63 57.08,62.01 | R7.1 57.93,61.95 arc-45 58.16,61.86 58.26,61.75 58.26,58.71 arc45 58.35,58.49 DIGITAL3.1 | IC4.54 v19.84,35.23 | 36.14,63.94 S2.1 35.88,63.77 35.88,62.87 36.49,62.16 v38.1,62.16 38.61,62.16 38.92,62.47 39.2,62.79 39.2,63.45 39.62,63.75 40.07,63.75 40.82,64.12 v42.7,64.12 | v36.59,42.72 37.21,43.05 37.67,43.1 38.17,42.6 IC3.41
  Top 0.305: 57.08,62.01 R7.1
  Bottom 0.254: DIGITAL3.1 58.36,57.42 44.12,42.88 v36.59,42.72 35.81,42.94 35.64,42.94 32.62,42.88 27.88,38.66 23.51,34.61 22.74,34.6 21.98,33.84 21.34,33.31 20.54,33.44 20.16,33.81 v19.84,35.23 | SD1.3 v38.1,62.16 | v42.7,64.12 43.43,64.44 43.98,64.45 53.91,64.45 54.37,63.74 v55.76,63.74 59.74,63.74 62.23,66.23 PMOD13.4
DIG17  (via drill 0.3)
  Top 0.254: IC4.51 21.21,34.48 v21.19,33.91 | R8.1 55.55,61.95 arc-45 55.78,61.86 55.88,61.75 DIGITAL3.2 | S2.2 38.68,63.82 38.8,63.82 39.81,64.58 v40.3,64.58 41.03,64.96 v42.76,64.98 | IC3.39 38.24,43.97 37.86,43.97 37.46,43.57 v36.43,43.41
  Top 0.305: v54.61,64.4 54.6,62.65 54.6,62.06 R8.1
  Bottom 0.254: v21.19,33.91 22.26,35.01 22.33,35.1 23.28,35.1 32.5,43.44 36.03,43.41 v36.43,43.41 43.75,43.38 55.62,55.5 55.62,58.29 DIGITAL3.2 | SD1.1 40.3,61.83 40.45,61.98 40.45,64.39 40.32,64.52 v40.3,64.58 | v54.61,64.4 57.61,64.4 59.69,66.48 PMOD13.3
  Bottom 0.305: v42.76,64.98 43.13,64.96 54.17,64.96 54.61,64.52 v54.61,64.4
DIG18  (via drill 0.3)
  Top 0.254: IC4.52 20.75,34.7 v20.59,34.48 | 53.23,61.8 R9.1 51.58,62.45 arc45 51.35,62.63 44.4,62.63 44.39,62.67 | 53.23,61.8 53.23,58.67 arc45 53.32,58.44 DIGITAL3.3 | 44.39,62.67 40.45,62.67 39.85,62.07 39.7,62.07 39.54,62.23 v39.54,62.19 | S1.1 44.39,62.67 | IC3.38 38.31,44.61 37.23,44.61 36.67,44.21 v36.67,44.1 | 53.23,61.8 53.35,61.8 53.72,62.17 53.72,64.58 55.69,66.55 55.69,69.6 57.15,71.06 PMOD13.2
  Bottom 0.254: v20.59,34.48 21.71,35.64 22.82,35.59 32.38,43.94 35.88,43.89 35.91,43.89 v36.67,44.1 37.19,43.89 37.39,43.89 43.5,43.94 53.34,53.96 DIGITAL3.3 | SD1.2 39.2,62 v39.54,62.19
DIG19  (via drill 0.3)
  Top 0.254: IC4.53 21.78,36.42 v22.51,36.21 | R10.1 v50.78,61.82 50.78,58.46 arc45 DIGITAL3.4 | S1.2 49.74,63.92 v50.35,63.56 53.02,63.56 53.28,63.75 53.28,64.9 54.61,66.17 PMOD13.1 | IC3.37 39.05,44.58 v39.05,44.67
  Top 0.305: R10.1 50.79,61.82 50.64,61.81 49.66,61.85 49.66,62.17 40.77,62.17 40.1,61.56 v35.88,61.56
  Bottom 0.254: v22.51,36.21 23.09,36.74 23.75,37 32.19,44.5 35.72,44.45 35.96,44.45 36.35,44.69 37.06,44.69 37.39,44.36 39.21,44.37 | 39.21,44.37 43.31,44.4 50.8,52.14 DIGITAL3.4 | v39.05,44.67 arc45 v39.05,44.67 39.05,44.53 39.21,44.37 | SD1.5 35.88,60.92 v35.88,61.56 | v50.35,63.56 50.8,62.87 50.78,62.85 v50.78,61.82
DONE  (via drill 0.3)
  Top 0.254: IC3.65 29.02,34.8 29.02,35.13 v28.9,35.25 25.88,38.33 25.55,38.8 24.36,40.03 | 24.36,40.03 23.91,40.52 21.59,40.5 IC4.59 18.47,37.37 18.47,35.31 17.17,33.88 v11.77,33.87 | v26.64,41.96 26.85,42.85 26.85,46.58 27.71,47.57 27.69,60.6 24.61,63.32 24.54,63.4 24.54,65.35 24.01,65.88 R26.1 | v24.97,40.34 24.5,39.92 24.36,40.03 | IC3.52 33.78,39.24 v33.66,39.31
  Bottom 0.254: v26.64,41.96 25.22,40.62 v24.97,40.34 | COMS.22 7.34,41.91 11.66,37.59 11.66,34.16 v11.77,33.87 | v33.66,39.31 32.64,38.23 31.75,38.23 29.03,35.69 v28.9,35.25
EMISO  (via drill 0.3)
  Top 0.254: COMS.21 5.11,42.98 6.87,42.98 8.06,41.78 9.18,42.98 17.71,51.88 v18.26,51.91 | v21.27,47.78 21.27,47.86 IC6.10
  Bottom 0.254: v18.26,51.91 21.27,49.05 v21.27,47.78
EMOSI  (via drill 0.3)
  Top 0.254: COMS.19 5.16,43.38 7.11,43.38 7.94,42.55 8.13,42.55 8.97,43.38 8.99,43.38 17.6,52.43 v18.57,52.55 | v24.77,43.5 24.23,44.03 IC6.6
  Bottom 0.254: v18.57,52.55 24.77,46.2 v24.77,43.5
ESCK  (via drill 0.3)
  Top 0.254: COMS.23 5.08,40.8 7.67,40.75 7.66,40.75 7.68,40.77 17.83,51.34 v17.96,51.23 | v21.93,45.1 21.75,44.45 21.75,43.71 IC6.3
  Bottom 0.254: v17.96,51.23 20.32,48.74 20.48,47.78 21.94,46.32 v21.93,45.1
GND  (via drill 0.3)
  Top 0.254: v25.39,43.86 25.39,44.66 IC6.8
  Top 0.406: C35.2 39.7,45.34 39.7,45.39 39.74,45.39
  other vias: 47.69,18.31 15.86,34.51 34.36,49.15 34.27,48.18 34.31,47.23 29.93,47.65 29.84,46.55 30.42,47.05 33.77,53.49 35.16,51.64 55.08,49.59 41.68,45.04 52.16,49.75 56.89,54.7 53.99,55.84 50.22,55.49 54.42,52.23 50.19,54.26 55.94,53.4 54.01,55.05 55.87,44.71 56.69,45.56 50.19,52.89 54.71,55.51 51.45,55.9 51.5,53.45 52.54,55.91 2.24,68.15 31.04,49.95 36.29,35.74 33.4,47.68 34.93,52.6 30.43,54.62 30.48,45.93 32.3,45.77 22.94,50.04 22.61,45.29 22.14,54.86 25.52,49.38 7.94,68.46 26.22,50.1 54.62,48.38 53.88,48.38 54.25,46.94 53.44,47 52.56,47 55.44,48.38 30.52,48.23 21.08,46.3 16.13,38.4 25.97,42.24 0.83,66.05 26.16,48.7 22.39,50.61 21.56,58.44 39.74,69.85 21.07,54.87 20.25,41.68 16.11,37.48 25.41,41.69 27.7,5.36 29.36,6.79 26.18,3.69 24.51,3.69 46.37,6.03 49.78,6.03 39.37,5.07 35.61,3.01 45.7,3.19 43.2,3.19 40.65,3.17 49.81,4.46 47.26,3.29 48.19,4.54 48.14,5.96 27.68,3.71 22.2,29.56 26.14,12.61 24.49,13.84 20.99,12.53 11.35,10.16 19.43,16.27 16.28,15.45 17.61,16.39 12.35,19.56 12.73,14.13 17.28,23.93 14.03,16.15 15.2,14.09 10.04,9.25 16.46,19.52 21.42,16.01 0.62,20.03 12.66,21.45 5.88,21 0.57,18.97 24.01,13.24 27.05,13.78 27.7,6.75 19.33,13.82 31.78,17.66 28.72,22.63 44.24,13.7 40.83,14.84 47.33,13.14 46.62,13.7 47.31,12.11 50.81,10.81 50.81,9.94 53.31,9.81 55.81,9.71 56.05,12 62.16,15.91 58.25,16.88 58.25,16 58.25,15 64.84,11.93 60.24,13.46 61.78,10.48 62.7,10.51 63.65,10.51 64.71,10.53 65.9,10.5 55.3,17.17 54.16,16.06 54.67,16.62 51.14,17.13 51.24,16.09 50.1,16.1 46.81,18.56 46.64,12.75 60.29,9.66 50.82,3.23 46.5,4.56 60.94,3.06 49.08,3.26 64.41,8.97 68.5,7.44 73.62,5.19 58.42,3.05 6.64,16.01 7.18,6.77 7.91,7.7 8.18,15.95 3.29,11.99 16.11,20.31 10.01,8.06 26.26,5.28 6.27,8.81 16.48,10.19 10.94,14.11 5.52,11.97 7.19,24.32 9.64,23.39 3.05,23.09 5.02,38.11 0.61,31.16 7.51,70.34 8.38,43.71 13.95,58.49 9.95,49.38 4.38,69.38 10.4,53.88 21.05,53.89 8.62,54.06 12.21,53.96 19.56,55.15 8.62,58.37 32.81,27.38 33.88,28.44 34.94,29.5 35.94,30.5 37.06,31.62 38.25,32.81 39.31,33.88 40.44,35 41.37,35.94 42.44,37.25 43.5,38.06 44.63,38.92 38.19,22.19 39.12,23.12 40.19,24.12 41.31,25.19 42.25,26.13 43.25,27.12 44.31,28.19 45.44,29.31 46.69,30.57 47.81,31.69 48.81,32.69 49.81,33.69 35.25,36.81 48.18,25.68 51.5,24.06 55.64,26.21 55.19,23.06 54.94,22.22 53.65,21.15 55.91,22.17 49.75,17.81 47.41,19.13 52.06,20.06 58.08,22.25 59.62,20.62 58.75,21.5 64.75,15.56 65.44,14.69 65.71,13.69 65.85,11.89 56.45,15.96 55.28,14.96 51.23,12.82 50.25,12.87 52.33,15.6 54.67,15.48 55.84,15.47 55.91,16.6 59.12,24.53 60.48,23.5 68.5,22.88 68.52,24.12 68.54,25.4 67.19,30.19 68.62,30.25 66.41,30.73 70.76,26.93 70.06,27.94 65.25,27.9 65.19,29.25 67.44,46.19 68.59,46.24 51.15,48.4 69.87,49.72 16.09,36.54 68.5,53.36 67.44,47.88 67.44,49.56 67.44,51.19 55.12,52.94 57.69,55.51 52.81,50.44 56.12,50 52.06,45 55.56,42.25 57.67,40.63 54.91,27.03 54.17,26.66 57.06,27.69 55.63,30.36 66.49,25.99 61.44,21 59.5,25.81 67.44,52.81 63.46,64.69 63.47,63.12 63.52,61.66 61.08,67.49 61.08,65.86 61.14,64.3 61.14,62.74 61.14,61.11 61.14,59.42 63.49,56.85 58.6,70.81 59.49,65.1 59.86,61.08 59.39,62.74 46.1,60.46 63.22,68 52.71,54.82 52,55.31 56.18,56 52.02,54.3 58.84,39.45 58.94,38.25 58.69,36.06 64.73,33.25 20.51,43.91 25.41,51.91 5.78,31.45 8.41,39.93 15.24,36.56 16.69,31.81 17.38,31.19 15.56,30 14.94,30.69 14.69,34.57 18.08,31.89 14.22,31.39 13.57,32.1 19.05,29.76 24.25,34.3 15.49,38.86 25.59,53 22.89,46.15 28.38,44.18 31.78,33.15 27.71,33.29 34.26,35.12 33.57,35.32 36.38,37.94 23.55,54.58 24.31,50.84 24.65,52.97 25.69,54.06 24.14,52.31 23.52,51.77 25.35,47.94 56.38,67.66 16.66,64.72 29.57,67.29 43.03,67.69 56.35,65.09 34.25,59 34.25,57.94 31.69,59.06 31.69,58 36.81,59 36.81,57.88 32.17,69.3 56.37,66.27 16.66,63.75 22.36,65.26 27.48,67.26 23.63,66.67 18.96,64.72 29.58,69.37 53.4,67.65 56.44,69.05 49.75,68.94 28.36,65.08 63.93,70.18 48.26,68.96 55.84,62.74 34.36,69.82 38.33,65.86 10.32,59.41 14.18,64.71 14.23,62.79 34.99,62.35 58.72,67.53 61.08,69.35 24.9,69.34 30.13,62.7 28.37,64.03 27.43,69.34 14.22,63.76 43.03,69 45.67,63.22 44.47,58.37 45.65,68.44 37.03,69.88 53.41,68.89 48.29,67.64 33.03,65.12 63.52,60.04 63.5,58.38 49.77,67.62 24.9,67.26 52.89,62.53 32.15,67.2 26.23,63.21 35.76,65.94 51.14,19.06 52.3,16.54 4.83,66.03 8.77,56.24 7.22,38.15 8.39,38.46 2.45,31.16 5.06,55.2 0.78,68.18 22.09,53.85 28.36,44.93 23.77,33.84 49.48,58.48 58.31,9.63 63.66,11.93 44.08,40.48 45.95,37.64 46.6,36.95 47.38,36.17 48.23,35.35 49.02,34.58 42.5,41.25 54.34,45.33 62.26,39.42 64.69,31.8 62.24,29.62 64.84,45.33 64.89,43.08 59.29,43.25 59.46,48.35 66.54,22.82 66.54,24.55 57.16,58.44 54.59,58.46 52.09,58.51 13.22,34.84 13.92,35.45 51.48,54.83 5.59,13.29 26.91,25.73 26.39,26.31 26.86,21.87 6.82,23.37 27.42,62.03 42.6,45 33.41,48.74 19.56,56.04 21.07,56.01 24.1,55.08 23.55,55.69 22.09,56.01 7.54,27.34 7.54,28.13 28.54,12.81 14.91,55.92 15.85,54.98 15.01,54.12 0.75,69.86 2.15,65.99 6.65,17.81 66.02,3.04 65.33,5.1 51.09,36.77 17.33,22.76 19.59,22.76 1.46,31.16 11.39,32.25 8.27,23.4 12.64,20.55 15.3,16.15 14,14.15 11.4,19.53 16.66,43.88 16.66,42.63 23.63,65.18 23.68,64.06 30.13,61.78 48.13,63.19 6.14,34.07 3.06,34.07 23.09,30.45 23.67,31.11 31.06,50.67 38.69,46.14 38.69,45.42 31.01,55.12 31.58,54.62 29.93,55.19 30.37,53.16 30.2,37.79 8.38,46.44 9.84,46.69 24.32,42.32 19.78,53.25 18.15,54.27 34.56,64.68 48.77,61.54 51.35,61.28 42.63,63.34 39.81,63.09
  pour Bottom (rank 2): 0,71.12 75,71.12 75,0 0,0
  pour Top (rank 2): 0,0 0,75 75,75 75,0
MISO  (via drill 0.3)
  Top 0.254: IC3.67 24.17,38.14 v23.72,39.04 | IC4.56 21.54,38.35 22.53,38.51 22.66,38.51 v22.97,38.19 | IC6.9 21.75,48.3 v21.94,48.13
  Bottom 0.254: v22.97,38.19 23.63,38.69 v23.72,39.04 23.72,46.34 v21.94,48.13
MOSI  (via drill 0.3)
  Top 0.254: IC3.68 28.34,33.37 28.23,33.58 27.91,33.89 27.7,33.97 23.62,38.02 23.62,38.32 v22.9,39.12 22.15,39.06 21.23,38.73 IC4.57 | IC6.7 23.89,45.24 23.5,45.24 v22.86,44.61
  Bottom 0.254: v22.86,44.61 22.9,44.52 v22.9,39.12
N$1
  Top 0.406: R6.2 PWR.A
N$2
  Top 0.254: R5.2 19.7,67.04 19.37,67.37 19.37,69.98 19.49,70.1 20.16,70.1 LED5.C
N$3
  Top 0.254: IC3.126 48.96,21.94 48.96,21.78 C9.2 50.02,20.68 R39.2
N$4
  Top 0.254: 3.77,21.68 4.19,21.68 U$2.SH@4
  Top 0.305: U$2.SH5 U$2.SH@2 U$2.SH@3 U$2.SH6 3.77,21.68 3.76,21.67
  Top 0.406: R22.1 C39.2 4,21.21 U$2.SH@4
N$5
  Top 0.406: IC7.3 31.75,51.32 31.75,52.65 R28.2 31.67,53.73 C62.2
N$6
  Top 0.254: IC3.53 33.58,38.73 33.34,38.8 33.05,39.09 C36.1
N$7  (via drill 0.3)
  Top 0.254: IC4.6 11.84,38.81 11.84,39.16 v11.38,39.62 | C34.2 8.92,51.61
  Top 0.305: v7.77,47.27 7.79,48.08 Y1.3
  Top 0.406: 8.92,51.61 Y1.3
  Bottom 0.254: v11.38,39.62 7.78,43.28
  Bottom 0.305: 7.78,43.28 v7.77,47.27
N$8
  Top 0.254: R44.1 52.7,20.38 53.06,20.32 | 53.06,20.32 R43.1 | X1.P3 53.06,18.68 53.06,20.32
N$9
  Top 0.61: 3.02,63.5 2.77,63.5
  Top 0.711: 7.37,63.5 3.02,63.5
  Top 1.27: F1.1 10.98,63.05 D3.C 7.95,63.07 7.37,63.5
  Top 1.422: 2.77,63.5 2.06,63.5 1.75,62.94 1.75,34.65 | 1.75,34.49 1.75,34.65 | 1.75,34.65 D1.C
N$10
  Top 0.406: COM.P$3 9.37,13.97 11.43,16.14 IC1.5
N$11
  Top 0.406: COM.P$2 8.59,14.62 10.16,16.19 IC1.6
N$12
  Top 0.254: COM.SH5 COM.SH@2 COM.SH@3 COM.SH6 1.75,9.7 | 3.97,10.39 COM.SH@4
  Top 0.305: 1.75,9.7 R24.1 C26.2 3.97,10.39
N$14
  Top 0.254: IC3.127 49.34,22.27 49.34,22.1 49.78,21.65 50.23,21.65 50.93,20.95 50.93,20.1 C9.1
N$15
  Top 0.254: R43.2 58.55,20.34 60.38,18.52 62.31,18.52 OLI-EXP.6
N$18
  Top 0.254: IC3.54 33.19,38.42 32.51,38.35 32.08,38.79 | 32.08,38.79 R38.1 | 32.08,38.79 32.26,38.97 32.26,40.43 C36.2
N$19  (via drill 0.3)
  Top 0.254: IC4.5 12.26,39.11 12.26,39.43 12,39.69 11.94,39.94 v11.44,40.44 | C27.2 9.83,45.98 v10.71,46.57
  Top 0.305: v10.71,46.57 Y1.1
  Bottom 0.254: v11.44,40.44 9.37,42.34
  Bottom 0.305: 9.37,42.34 9.4,44.97 v10.71,46.57
N$20
  Top 0.254: C41.2 10.38,21.92
  Top 0.406: IC1.7 8.87,20.77 Y2.3 10.38,21.92
N$21
  Top 0.254: 7.16,20.06 Y2.1
  Top 0.406: IC1.8 7.67,19.55 Y2.1 | C40.2 7.16,20.06
N$22
  Top 0.254: R26.2 22.85,67.04 23.18,67.37 23.18,69.91 22.99,70.1 22.37,70.1 LED6.C
OE  (via drill 0.3)
  Top 0.254: IC4.4 12.7,39.39 12.62,39.77 12.54,39.85 12.41,41.29 16.83,45.71 16.85,46.2 17.49,46.83 | 17.49,46.83 17.7,46.83 IC6.15 | v11.43,48.96 13.59,48.96 13.84,49.34 v15.15,50.67 | 17.49,46.83 16.83,46.16 16.83,45.72 16.7,45.59 v16.57,45.59
  Bottom 0.254: COMS.15 5.02,48.32 6.92,48.32 8,48.77 11.37,48.77 v11.43,48.96 | v16.57,45.59 16.38,45.78 15.3,45.78 15.18,45.91 v15.15,50.67
P0  (via drill 0.3)
  Top 0.254: IC3.94 32.65,19.38 v31.25,18.75 | IC1.9 7.62,8.57 5.71,6.67 5.71,4 7.18,2.22 19.62,2.22 v20.32,3.17
  Bottom 0.254: v31.25,18.75 30.73,18.15 30.77,17.51 26.39,11.8 26.37,8.31 24.41,6.35 PMOD1/2.11 20.32,5.08 v20.32,3.17
P1  (via drill 0.3)
  Top 0.254: v31.75,20.81 32.27,21.12 IC3.91 34.29,23.14 34.29,23.3 33.97,23.62 33.97,24.07 v33.92,24.77 | v22.86,7.62 22.07,7.62 20.32,7.62 PMOD1/2.9 17.78,5.08 17.78,3.3 17.08,2.67 13.21,2.67 12.83,3.11 12.83,6.99 13.97,8.13 IC1.14 | IC3.128 49.85,22.47 v49.97,22.29
  Bottom 0.254: v31.75,20.81 30.56,20.7 23.77,11.75 23.77,8.58 v22.86,7.62 | v49.97,22.29 49.02,21.4 49.02,20.45 48.39,19.81 47.12,19.81 46.29,19.05 43.24,18.99 42.1,17.78 39.69,17.78 34.99,22.54 35.43,23.88 34.35,24.89 33.99,24.77 v33.92,24.77
P2  (via drill 0.3)
  Top 0.254: IC3.88 31.9,22.88 v31.5,22.75 | R27.2 24.04,15.69 v24.04,15.08
  Bottom 0.254: v31.5,22.75 30.82,22.14 29.83,21.51 v24.04,15.08 | v24.04,15.08 23.68,14.68 | 23.68,14.68 21.36,12.12 21.38,8.62 20.69,7.94 18.1,7.94 PMOD1/2.7 | v24.04,15.08 23.68,14.72 23.68,14.68
P3  (via drill 0.3)
  Top 0.254: IC3.85 30.41,23.5 v30.38,23.25 | v18.72,8.83 17.99,8.1 14.92,8.1 13.97,7.14 PMOD1/2.5 | R25.2 23.01,18.34 23.01,17.58 23.65,16.94 v23.67,16.95
  Bottom 0.254: v30.38,23.25 29.81,22.81 v23.67,16.95 | v23.67,16.95 23.56,16.81 | 23.56,16.81 18.72,12.18 v18.72,8.83 | v23.67,16.95 23.56,16.81
P4  (via drill 0.3)
  Top 0.254: IC3.95 32.98,19 v32.12,18.5
  Bottom 0.254: v32.12,18.5 31.25,18.02 31.16,17.23 26.95,11.66 26.93,7.17 23.57,3.81 PMOD1/2.12
P5  (via drill 0.3)
  Top 0.254: IC3.93 32.44,19.88 v31.38,19.5 | v24.44,8.49 24.44,6.82 22.7,5.08 20.32,5.08 PMOD1/2.10
  Bottom 0.254: v31.38,19.5 30.95,19.3 30.12,18.28 24.44,11.67 v24.44,8.49
P6  (via drill 0.3)
  Top 0.254: IC3.90 32.57,22.12 v31.88,21.62
  Bottom 0.254: v31.88,21.62 31.55,21.54 30.14,21.07 21.97,11.94 21.86,8.44 20.88,7.46 18.66,7.49 17.62,6.45 17.62,5.08 16.51,3.97 PMOD1/2.8
P7  (via drill 0.3)
  Top 0.254: IC3.87 31.7,23.38 v31.12,23.38 | v19.37,8.49 18.5,7.62 16.03,7.62 15.24,6.83 15.24,5.08 PMOD1/2.6
  Bottom 0.254: v31.12,23.38 31,23.25 30.88,22.88 30.25,22.31 29.76,22.13 19.33,11.82 v19.37,8.49
P8  (via drill 0.3)
  Top 0.254: IC3.105 37.25,16.2 v37.25,15.75
  Bottom 0.254: v37.25,15.75 37.38,14.85 40.99,14.16 40.99,8.84 41.34,8.41 42.39,8.41 42.39,8.1 43.34,7.14 43.66,7.14 PMOD3/4.11
P9  (via drill 0.3)
  Top 0.254: IC3.102 37,18.07 v37,17.5
  Bottom 0.254: v37,17.5 35.85,16.41 35.92,8.8 36.15,8.64 39.85,8.64 41.91,6.51 PMOD3/4.9
P10  (via drill 0.3)
  Top 0.254: IC3.99 35.12,18.32 v35,17.62